# EAGLE design shield-v2.0 (EAGLE 8.3.1)
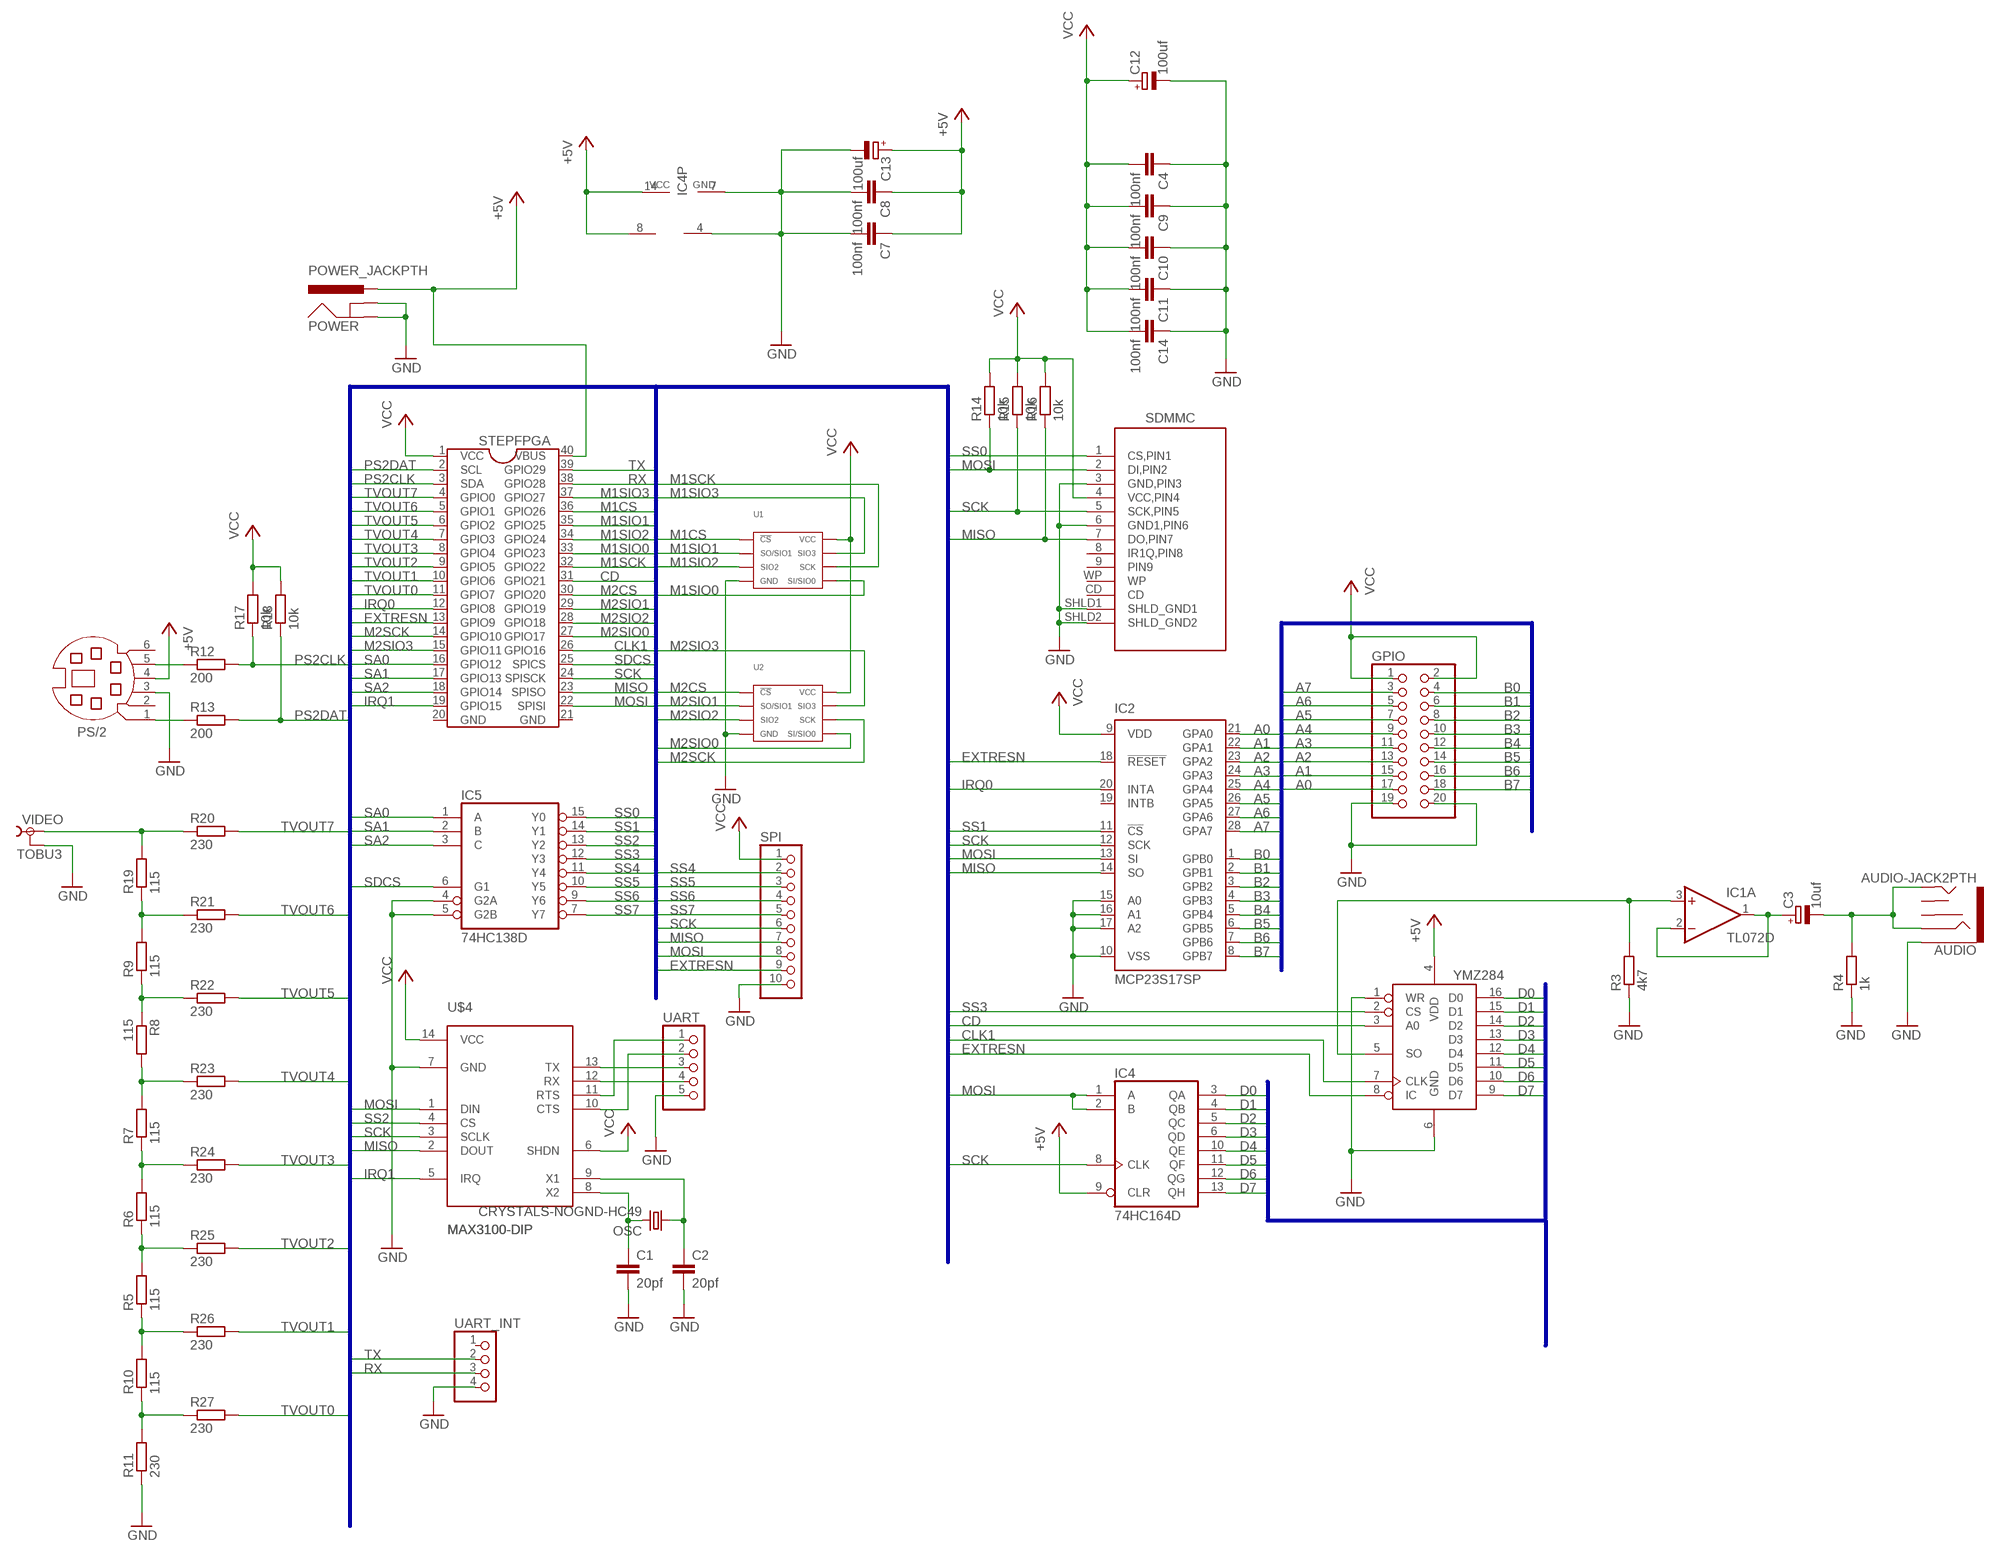
[diagram p0: schematic, sheet 1]

## Parts
AUDIO  AUDIO-JACK2PTH  [AUDIO-JACK]
C1  20pf  CAP1206  [1206]
C2  20pf  CAP1206  [1206]
C3  10uf  CPOL-EUE5-5  [E5-5]
C4  100nf  CAP1206  [1206]
C7  100nf  CAP1206  [1206]
C8  100nf  CAP1206  [1206]
C9  100nf  CAP1206  [1206]
C10  100nf  CAP1206  [1206]
C11  100nf  CAP1206  [1206]
C12  100uf  CPOL-EUE5-5  [E5-5]
C13  100uf  CPOL-EUE5-5  [E5-5]
C14  100nf  CAP1206  [1206]
GPIO  PINHD-2X10  [2X10]
IC1  TL072D  [SO08]
IC2  MCP23S17SP  [DIL28-3]
IC3  YMZ284  [DIL16]
IC4  74HC164D  [SO14]
IC5  74HC138D  [SO16]
OSC  CRYSTALS-NOGND-HC49  [HC49]
POWER  POWER_JACKPTH  [POWER_JACK_PTH]
PS/2  MD06SS  [MDIN06SS]
R3  4k7  R-EU_R1206  [R1206]
R4  1k  R-EU_R1206  [R1206]
R5  115  R-EU_R1206  [R1206]
R6  115  R-EU_R1206  [R1206]
R7  115  R-EU_R1206  [R1206]
R8  115  R-EU_R1206  [R1206]
R9  115  R-EU_R1206  [R1206]
R10  115  R-EU_R1206  [R1206]
R11  230  R-EU_R1206  [R1206]
R12  200  R-EU_R1206  [R1206]
R13  200  R-EU_R1206  [R1206]
R14  10k  R-EU_R1206  [R1206]
R15  10k  R-EU_R1206  [R1206]
R16  10k  R-EU_R1206  [R1206]
R17  10k  R-EU_R1206  [R1206]
R18  10k  R-EU_R1206  [R1206]
R19  115  R-EU_R1206  [R1206]
R20  230  R-EU_R1206  [R1206]
R21  230  R-EU_R1206  [R1206]
R22  230  R-EU_R1206  [R1206]
R23  230  R-EU_R1206  [R1206]
R24  230  R-EU_R1206  [R1206]
R25  230  R-EU_R1206  [R1206]
R26  230  R-EU_R1206  [R1206]
R27  230  R-EU_R1206  [R1206]
SDMMC  FCI_SD_SOCKET  [SD-MMC_SOCKET-PP]
SPI  PINHD-1X10  [1X10]
STEPFPGA  STEPFPGA  [DIL40]
U1  23A1024/23LC1024-I/SN  [23A1024_SOIC-8]
U2  23A1024/23LC1024-I/SN  [23A1024_SOIC-8]
U$4  MAX3100-DIP  [DIL14]
UART  PINHD-1X5  [1X05]
UART_INT  PINHD-1X4  [1X04]
VIDEO  TOBU3  [TOBU3]

## Nets
+5V: C7.1 C8.1 C13.+ IC1.8(P:V+) IC3.4(VDD) IC4.9(CLR) IC4.14(VCC) POWER.PWR PS/2.4 STEPFPGA.40(VBUS)
A0: GPIO.17 IC2.21(GPA0)
A1: GPIO.15 IC2.22(GPA1)
A2: GPIO.13 IC2.23(GPA2)
A3: GPIO.11 IC2.24(GPA3)
A4: GPIO.9 IC2.25(GPA4)
A5: GPIO.7 IC2.26(GPA5)
A6: GPIO.5 IC2.27(GPA6)
A7: GPIO.3 IC2.28(GPA7)
B0: GPIO.4 IC2.1(GPB0)
B1: GPIO.6 IC2.2(GPB1)
B2: GPIO.8 IC2.3(GPB2)
B3: GPIO.10 IC2.4(GPB3)
B4: GPIO.12 IC2.5(GPB4)
B5: GPIO.14 IC2.6(GPB5)
B6: GPIO.16 IC2.7(GPB6)
B7: GPIO.18 IC2.8(GPB7)
CD: IC3.3(A0) STEPFPGA.31(GPIO21)
CLK1: IC3.7(CLK) STEPFPGA.26(GPIO16)
D0: IC3.16(D0) IC4.3(QA)
D1: IC3.15(D1) IC4.4(QB)
D2: IC3.14(D2) IC4.5(QC)
D3: IC3.13(D3) IC4.6(QD)
D4: IC3.12(D4) IC4.10(QE)
D5: IC3.11(D5) IC4.11(QF)
D6: IC3.10(D6) IC4.12(QG)
D7: IC3.9(D7) IC4.13(QH)
EXTRESN: IC2.18(!RESET) IC3.8(IC) SPI.9 STEPFPGA.13(GPIO9)
GND: AUDIO.SLEEVE C1.2 C2.2 C4.1 C7.2 C8.2 C9.1 C10.1 C11.1 C12.- C13.- C14.1 GPIO.19 GPIO.20 IC1.4(P:V-) IC2.10(VSS) IC2.15(A0) IC2.16(A1) IC2.17(A2) IC3.1(WR) IC3.6(GND) IC4.7(GND) IC5.4(G2A) IC5.5(G2B) POWER.GND POWER.GNDBREAK PS/2.3 R3.1 R4.1 R11.1 SDMMC.3(GND,PIN3) SDMMC.6(GND1,PIN6) SDMMC.SHLD1(SHLD_GND1) SDMMC.SHLD2(SHLD_GND2) SPI.10 U1.4(GND) U2.4(GND) U$4.7(GND) UART.5 UART_INT.4 VIDEO.2 VIDEO.2@1 VIDEO.2@2
IRQ0: IC2.20(INTA) STEPFPGA.12(GPIO8)
IRQ1: STEPFPGA.19(GPIO15) U$4.5(IRQ)
M1CS: STEPFPGA.36(GPIO26) U1.1(CS')
M1SCK: STEPFPGA.32(GPIO22) U1.6(SCK)
M1SIO0: STEPFPGA.33(GPIO23) U1.5(SI/SIO0)
M1SIO1: STEPFPGA.35(GPIO25) U1.2(SO/SIO1)
M1SIO2: STEPFPGA.34(GPIO24) U1.3(SIO2)
M1SIO3: STEPFPGA.37(GPIO27) U1.7(SIO3)
M2CS: STEPFPGA.30(GPIO20) U2.1(CS')
M2SCK: STEPFPGA.14(GPIO10) U2.6(SCK)
M2SIO0: STEPFPGA.27(GPIO17) U2.5(SI/SIO0)
M2SIO1: STEPFPGA.29(GPIO19) U2.2(SO/SIO1)
M2SIO2: STEPFPGA.28(GPIO18) U2.3(SIO2)
M2SIO3: STEPFPGA.15(GPIO11) U2.7(SIO3)
MISO: IC2.14(SO) R16.1 SDMMC.7(DO,PIN7) SPI.7 STEPFPGA.23(SPISO) U$4.2(DOUT)
MOSI: IC2.13(SI) IC4.1(A) IC4.2(B) R14.1 SDMMC.2(DI,PIN2) SPI.8 STEPFPGA.22(SPISI) U$4.1(DIN)
N$2: C1.1 OSC.2 U$4.8(X2)
N$3: U$4.13(TX) UART.3
N$4: U$4.12(RX) UART.4
N$5: U$4.11(RTS) UART.1
N$6: U$4.10(CTS) UART.2
N$7: C2.1 OSC.1 U$4.9(X1)
N$8: IC1.3(A:+IN) IC3.5(SO) R3.2
N$9: C3.+ IC1.1(A:OUT) IC1.2(A:-IN)
N$10: R19.2 R20.1 VIDEO.1
N$11: AUDIO.RING AUDIO.TIP C3.- R4.2
N$13: R9.2 R19.1 R21.1
N$14: R8.1 R9.1 R22.1
N$15: R7.2 R8.2 R23.1
N$16: R6.2 R7.1 R24.1
N$17: R5.2 R6.1 R25.1
N$18: R5.1 R10.2 R26.1
N$19: R10.1 R11.2 R27.1
N$23: PS/2.5 R12.1
N$24: PS/2.1 R13.1
PS2CLK: R12.2 R17.1 STEPFPGA.3(SDA)
PS2DAT: R13.2 R18.1 STEPFPGA.2(SCL)
RX: STEPFPGA.38(GPIO28) UART_INT.3
SA0: IC5.1(A) STEPFPGA.16(GPIO12)
SA1: IC5.2(B) STEPFPGA.17(GPIO13)
SA2: IC5.3(C) STEPFPGA.18(GPIO14)
SCK: IC2.12(SCK) IC4.8(CLK) R15.1 SDMMC.5(SCK,PIN5) SPI.6 STEPFPGA.24(SPISCK) U$4.3(SCLK)
SDCS: IC5.6(G1) STEPFPGA.25(SPICS)
SS0: IC5.15(Y0) SDMMC.1(CS,PIN1)
SS1: IC2.11(!CS) IC5.14(Y1)
SS2: IC5.13(Y2) U$4.4(CS)
SS3: IC3.2(CS) IC5.12(Y3)
SS4: IC5.11(Y4) SPI.2
SS5: IC5.10(Y5) SPI.3
SS6: IC5.9(Y6) SPI.4
SS7: IC5.7(Y7) SPI.5
TVOUT0: R27.2 STEPFPGA.11(GPIO7)
TVOUT1: R26.2 STEPFPGA.10(GPIO6)
TVOUT2: R25.2 STEPFPGA.9(GPIO5)
TVOUT3: R24.2 STEPFPGA.8(GPIO4)
TVOUT4: R23.2 STEPFPGA.7(GPIO3)
TVOUT5: R22.2 STEPFPGA.6(GPIO2)
TVOUT6: R21.2 STEPFPGA.5(GPIO1)
TVOUT7: R20.2 STEPFPGA.4(GPIO0)
TX: STEPFPGA.39(GPIO29) UART_INT.2
VCC: C4.2 C9.2 C10.2 C11.2 C12.+ C14.2 GPIO.1 GPIO.2 IC2.9(VDD) R14.2 R15.2 R16.2 R17.2 R18.2 SDMMC.4(VCC,PIN4) SPI.1 STEPFPGA.1(VCC) U1.8(VCC) U2.8(VCC) U$4.6(SHDN) U$4.14(VCC)
Unconnected: AUDIO.RSH AUDIO.TSH IC1.5(B:+IN) IC1.6(B:-IN) IC1.7(B:OUT) IC2.19(INTB) PS/2.2 PS/2.6 SDMMC.8(IR1Q,PIN8) SDMMC.9(PIN9) SDMMC.CD SDMMC.WP UART_INT.1

## Buses
PS2DAT,PS2CLK,RX,TX,TVOUT[0..7],MISO,MOSI,SCK,SDCS,EXTRESN,M1CS,M1SIO0,M1SIO1,M1SIO2,M1SIO3,M1SCK,M2CS,M2SIO0,M2SIO1,M2SIO2,M2SIO3,M2SCK,SS[0..7],SA[0..2],CD,CLK1,IRQ[0..1]
D[0..7]
A[0..7],B[0..7]

## Power pins joined to a net without a drawn wire
GND: IC5.8(GND) STEPFPGA.20(GND) STEPFPGA.21(GND)
VCC: IC5.16(VCC)

## Library data of the parts
AUDIO = SparkFun:AUDIO-JACK2
C1 C2 C4 C7-C11 C14 = SparkFun:CAP: Capacitor Standard 0603 ceramic capacitor, and 0.1" leaded capacitor.
C3 C12 C13 = rcl:CPOL-EU: POLARIZED CAPACITOR, European symbol
GPIO = pinhead:PINHD-2X10: PIN HEADER
IC1 = linear:TL072: OP AMP
IC2 = microchip:MCP23S17: http://ww1.microchip.com/downloads/en/DeviceDoc/21952a.pdf Source: http://ww1.microchip.com/downloads/en/DeviceDoc/21952a.pdf; MF: MICROCHIP; MPN: MCP23S17-E/SP; OC_FARNELL: 1292238; OC_NEWARK: 31K2951
IC3 = stepfpga:YMZ284
IC4 = 74xx-eu:74*164: 8-bit parallel out SHIFT REGISTER
IC5 = 74xx-eu:74*138: 3-line to 8-line DECODER/DEMULTIPLEXER
OSC = IQD-Frequency-Products:CRYSTALS-NOGND: CRYSTALS CAN NOT GROUNDED
POWER = SparkFun:POWER_JACK: Power Jack This is the standard 5.5mm barrel jack for power. The PTH is the most common, proven, reliable, footprint. All others are experimental. The Slot footprint only works if the mill layer is transmitted to the PCB fab house so be warned. Spark Fun Electronics SKU : PRT-00119. Mating wall wart : TOL-00298 (and others)
PS/2 = con-yamaichi:MD06SS: YAMAICHI CONNECTOR; OC_FARNELL: unknown; OC_NEWARK: unknown
R3-R27 = resistor:R-EU_: RESISTOR, European symbol
SDMMC = stepfpga:FCI_SD_SOCKET: FCI Memory Card Connector (SD card); MF: FCI; MOUSER: 649-10067847-001RLF; MPN: 10067847-001RLF
SPI = pinhead:PINHD-1X10: PIN HEADER
STEPFPGA = stepfpga:STEPFPGA: StepFPGA module
U1 U2 = stepfpga:23A1024/23LC1024: Manufacturer Part #: 23A1024/23LC1024 Manufacturer: Microchip Technology Description: SRAM 1024K 1.8V SPI SERIAL SRAM SQI
U$4 = stepfpga:MAX3100: UART to SPI controller
UART = pinhead:PINHD-1X5: PIN HEADER
UART_INT = pinhead:PINHD-1X4: PIN HEADER
VIDEO = con-hirschmann:TOBU3: Female Cinch CONNECTOR ( RCA Jack ); MF: FARNELL; MPN: TOBU 3; OC_FARNELL: 592791; OC_NEWARK: 06WX5914

## Board
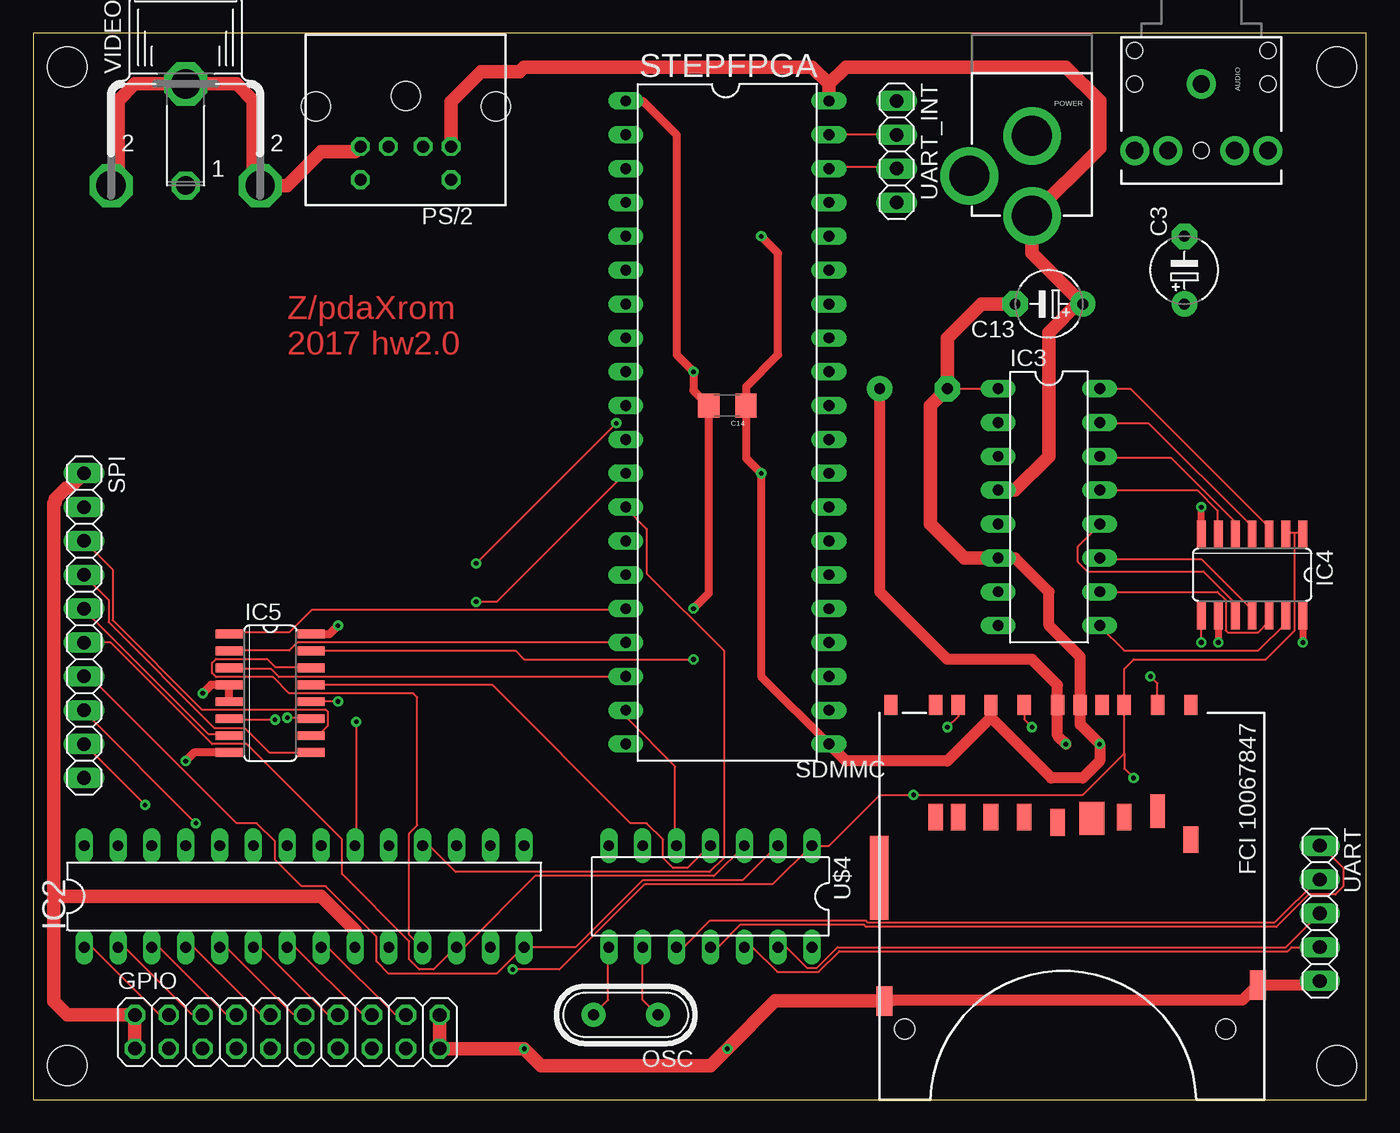
[diagram p1: board, top side]
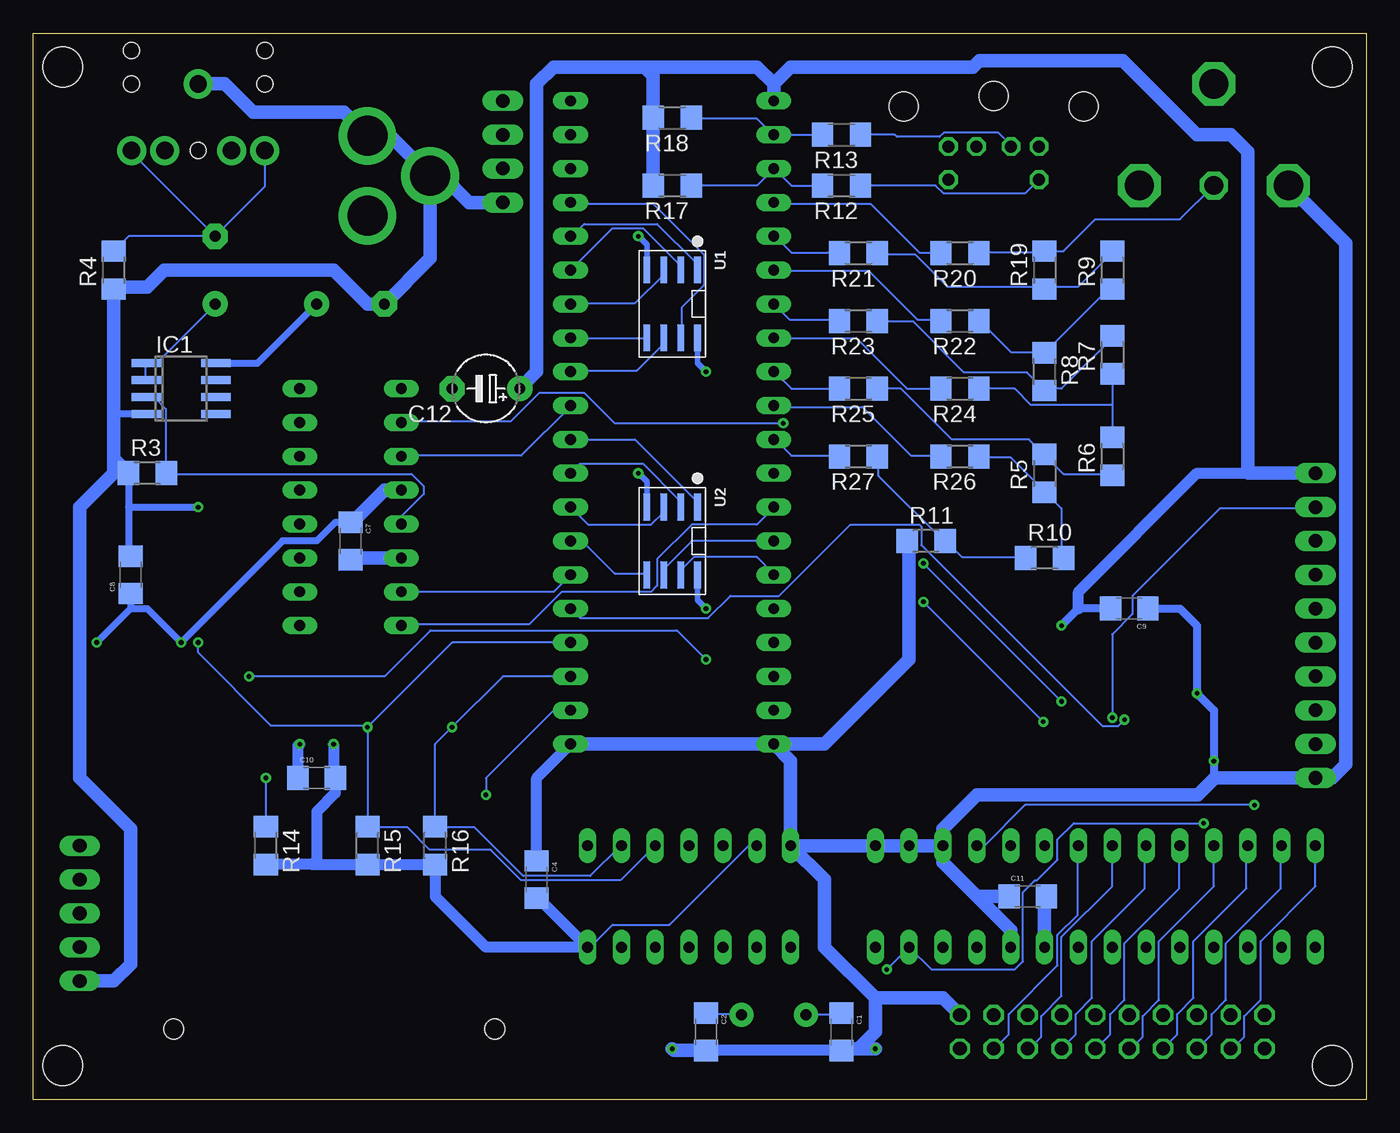
[diagram p2: board, bottom side, seen from below]

Size 100 x 80 mm. Coordinates in mm from the lower left corner, seen from the top.
Outline: 0,0 100,0 100,80 0,80 0,0
Copper layers (1*16): Top 0.035mm / dielectric 1.5mm / Bottom 0.035mm
Design rules "default *": minimum track width 6mil, minimum drill 0.35mm, track to track 6mil, track to pad 6mil, pad to pad 6mil, via to via 6mil, smd to smd 6mil, copper to edge 40mil, drill to drill 6mil, minimum pad ring 10mil, minimum via ring 8mil, stop-mask expansion 4mil, vias tented up to drill 0mil, thermal gap 10mil
Holes 3 mm at 2.54,2.54 97.79,2.54 97.79,77.47 2.54,77.47

### Footprints (pad centres in the part's own frame; a part is rotated, then mirrored left to right if it is on the bottom)
AUDIO-JACK = drill 1.3 pad 2.184: RING 5,5; RSH 5,2.5; SLEEVE 0,0; TIP 5,-5; TSH 5,-2.5 | hole 1.2: 0,5; -2.5,5; -2.5,-5; 0,-5; 5,0
1206 = smd 1.6 x 1.8: 1 -1.4,0; 2 1.4,0
E5-5 = drill 0.813 pad 1.905: + -2.54,0 | drill 0.813 pad 1.905 octagon: - 2.54,0
2X10 = drill 1.016 octagon: 1 -11.43,-1.27; 2 -11.43,1.27; 3 -8.89,-1.27; 4 -8.89,1.27; 5 -6.35,-1.27; 6 -6.35,1.27; 7 -3.81,-1.27; 8 -3.81,1.27; 9 -1.27,-1.27; 10 -1.27,1.27; 11 1.27,-1.27; 12 1.27,1.27; 13 3.81,-1.27; 14 3.81,1.27; 15 6.35,-1.27; 16 6.35,1.27; 17 8.89,-1.27; 18 8.89,1.27; 19 11.43,-1.27; 20 11.43,1.27
SO08 = smd 0.6 x 2.2: 1 -1.905,-2.6; 2 -0.635,-2.6; 3 0.635,-2.6; 4 1.905,-2.6; 5 1.905,2.6; 6 0.635,2.6; 7 -0.635,2.6; 8 -1.905,2.6
DIL28-3 = drill 0.813 long: 1 -16.51,-3.81; 2 -13.97,-3.81; 3 -11.43,-3.81; 4 -8.89,-3.81; 5 -6.35,-3.81; 6 -3.81,-3.81; 7 -1.27,-3.81; 8 1.27,-3.81; 9 3.81,-3.81; 10 6.35,-3.81; 11 8.89,-3.81; 12 11.43,-3.81; 13 13.97,-3.81; 14 16.51,-3.81; 15 16.51,3.81; 16 13.97,3.81; 17 11.43,3.81; 18 8.89,3.81; 19 6.35,3.81; 20 3.81,3.81; 21 1.27,3.81; 22 -1.27,3.81; 23 -3.81,3.81; 24 -6.35,3.81; 25 -8.89,3.81; 26 -11.43,3.81; 27 -13.97,3.81; 28 -16.51,3.81
DIL16 = drill 0.813 long: 1 -8.89,-3.81; 2 -6.35,-3.81; 3 -3.81,-3.81; 4 -1.27,-3.81; 5 1.27,-3.81; 6 3.81,-3.81; 7 6.35,-3.81; 8 8.89,-3.81; 9 8.89,3.81; 10 6.35,3.81; 11 3.81,3.81; 12 1.27,3.81; 13 -1.27,3.81; 14 -3.81,3.81; 15 -6.35,3.81; 16 -8.89,3.81
SO14 = smd 0.66 x 2.032: 1 -3.81,-3.073; 2 -2.54,-3.073; 3 -1.27,-3.073; 4 0,-3.073; 5 1.27,-3.073; 6 2.54,-3.073; 7 3.81,-3.073; 8 3.81,3.073; 9 2.54,3.073; 10 1.27,3.073; 11 0,3.073; 12 -1.27,3.073; 13 -2.54,3.073; 14 -3.81,3.073
SO16 = smd 0.66 x 2.032: 1 -4.445,-3.073; 2 -3.175,-3.073; 3 -1.905,-3.073; 4 -0.635,-3.073; 5 0.635,-3.073; 6 1.905,-3.073; 7 3.175,-3.073; 8 4.445,-3.073; 9 4.445,3.073; 10 3.175,3.073; 11 1.905,3.073; 12 0.635,3.073; 13 -0.635,3.073; 14 -1.905,3.073; 15 -3.175,3.073; 16 -4.445,3.073
HC49 = drill 0.813 pad 1.8: 1 -2.413,0; 2 2.413,0
POWER_JACK_PTH = drill 2.997 pad 4.318: GND 0,7.7; GNDBREAK 4.7,10.7; PWR 0,13.7
MDIN06SS = drill 0.9 octagon: 1 1.3,8.5; 2 -1.3,8.5; 3 3.4,8.5; 4 -3.4,8.5; 5 3.4,11; 6 -3.4,11 | hole 2.2: -6.75,5.5; 0,4.7; 6.75,5.5
R1206 = smd 1.6 x 1.803: 1 -1.422,0; 2 1.422,0
SD-MMC_SOCKET-PP = smd 1 x 1.5: 1 6.875,29.6; 2 4.375,29.6; 3 1.075,29.6; 4 -0.625,29.6; 5 -3.125,29.6; 6 -5.625,29.6; 7 -8.075,29.6; 8 -9.775,29.6; 9 9.375,29.6; CD 2.725,29.6; WP -13.125,29.6 | smd 1.4 x 6.3: 14 -14,16.65 | smd 1.2 x 2.2: SHLD1 -13.6,7.4; SHLD2 14.4,8.6 | smd 1.1 x 2: SW -9.775,21.2; SW1 -8.075,21.2; SW2 -5.625,21.2; SW3 -3.125,21.2; SW4 -0.625,20.8; SW6 4.375,21.2; SW8 9.375,19.5 | smd 1.9 x 2.5: SW5 1.95,21.1 | smd 1.1 x 2.5: SW7 6.875,21.65 | hole 1.5: -12.1,5.3; 12,5.3
1X10 = drill 1.016 long: 1 -11.43,0; 2 -8.89,0; 3 -6.35,0; 4 -3.81,0; 5 -1.27,0; 6 1.27,0; 7 3.81,0; 8 6.35,0; 9 8.89,0; 10 11.43,0
DIL40 = drill 0.813 long: 1 -24.13,-7.62; 2 -21.59,-7.62; 3 -19.05,-7.62; 4 -16.51,-7.62; 5 -13.97,-7.62; 6 -11.43,-7.62; 7 -8.89,-7.62; 8 -6.35,-7.62; 9 -3.81,-7.62; 10 -1.27,-7.62; 11 1.27,-7.62; 12 3.81,-7.62; 13 6.35,-7.62; 14 8.89,-7.62; 15 11.43,-7.62; 16 13.97,-7.62; 17 16.51,-7.62; 18 19.05,-7.62; 19 21.59,-7.62; 20 24.13,-7.62; 21 24.13,7.62; 22 21.59,7.62; 23 19.05,7.62; 24 16.51,7.62; 25 13.97,7.62; 26 11.43,7.62; 27 8.89,7.62; 28 6.35,7.62; 29 3.81,7.62; 30 1.27,7.62; 31 -1.27,7.62; 32 -3.81,7.62; 33 -6.35,7.62; 34 -8.89,7.62; 35 -11.43,7.62; 36 -13.97,7.62; 37 -16.51,7.62; 38 -19.05,7.62; 39 -21.59,7.62; 40 -24.13,7.62
23A1024_SOIC-8 = smd 2 x 0.5: 1 -2.55,1.905; 2 -2.55,0.635; 3 -2.55,-0.635; 4 -2.55,-1.905; 5 2.55,-1.905; 6 2.55,-0.635; 7 2.55,0.635; 8 2.55,1.905
DIL14 = drill 0.813 long: 1 -7.62,-3.81; 2 -5.08,-3.81; 3 -2.54,-3.81; 4 0,-3.81; 5 2.54,-3.81; 6 5.08,-3.81; 7 7.62,-3.81; 8 7.62,3.81; 9 5.08,3.81; 10 2.54,3.81; 11 0,3.81; 12 -2.54,3.81; 13 -5.08,3.81; 14 -7.62,3.81
1X05 = drill 1.016 long: 1 -5.08,0; 2 -2.54,0; 3 0,0; 4 2.54,0; 5 5.08,0
1X04 = drill 1.016 long: 1 -3.81,0; 2 -1.27,0; 3 1.27,0; 4 3.81,0
TOBU3 = drill 1.397 octagon: 1 0,-2.54 | drill 2.21 octagon: 2 5.588,-2.54; 2@1 -5.588,-2.54; 2@2 0,5.08

### Placement (x,y rotation side)
AUDIO  87.63,76.2 270 top
C1  39.37,5.08 270 bottom
C2  49.53,5.08 270 bottom
C3  86.36,62.23 90 top
C4  62.23,16.51 270 bottom
C7  76.2,41.91 270 bottom
C8  92.71,39.37 90 bottom
C9  17.78,36.83 180 bottom
C10  78.74,24.13 0 bottom
C11  25.4,15.24 0 bottom
C12  66.04,53.34 180 bottom
C13  76.2,59.69 180 top
C14  52.07,52.07 180 top
GPIO  19.05,5.08 0 top
IC1  88.9,53.34 270 bottom
IC2  20.32,15.24 0 top
IC3  76.2,44.45 270 top
IC4  91.44,39.37 180 top
IC5  17.78,30.48 270 top
OSC  44.45,6.35 180 top
POWER  74.93,80.01 180 top
PS/2  27.94,80.01 180 top
R3  91.44,46.99 0 bottom
R4  93.98,62.23 90 bottom
R5  24.13,46.99 90 bottom
R6  19.05,48.26 90 bottom
R7  19.05,55.88 90 bottom
R8  24.13,54.61 270 bottom
R9  19.05,62.23 90 bottom
R10  24.13,40.64 0 bottom
R11  33.02,41.91 0 bottom
R12  39.37,68.58 180 bottom
R13  39.37,72.39 180 bottom
R14  82.55,19.05 270 bottom
R15  74.93,19.05 270 bottom
R16  69.85,19.05 270 bottom
R17  52.07,68.58 180 bottom
R18  52.07,73.66 180 bottom
R19  24.13,62.23 90 bottom
R20  30.48,63.5 180 bottom
R21  38.1,63.5 180 bottom
R22  30.48,58.42 180 bottom
R23  38.1,58.42 180 bottom
R24  30.48,53.34 180 bottom
R25  38.1,53.34 180 bottom
R26  30.48,48.26 180 bottom
R27  38.1,48.26 180 bottom
SDMMC  77.47,0 0 top
SPI  3.81,35.56 270 top
STEPFPGA  52.07,50.8 270 top
U1  52.07,59.69 270 bottom
U2  52.07,41.91 270 bottom
U$4  50.8,15.24 180 top
UART  96.52,13.97 270 top
UART_INT  64.77,71.12 270 top
VIDEO  11.43,71.12 0 top

### Tracks (layer width: path | path; a pad name or v marks a point on that pad's centre or on a via)
+5V  (via drill 0.35)
  Top 0.508: IC4.14 v95.25,34.29 | IC4.9 v88.9,34.29
  Top 1.016: PS/2.4 31.34,74.87 33.6,77.13 36.49,77.13 36.83,77.47 58.42,77.47 59.69,76.2 | STEPFPGA.40 59.69,76.2 | 59.69,76.2 60.96,77.47 77.47,77.47 80.01,74.93 80.01,71.39 POWER.PWR 74.93,63.5 78.54,59.89 | 78.54,59.89 C13.+ | IC3.4 73.66,45.72 76.2,48.26 76.2,57.56 78.54,59.89
  Bottom 0.508: IC1.8 83.19,55.24 C13.+ | C8.1 92.71,36.83 | 92.71,36.83 v95.25,34.29 | 92.71,36.83 91.44,36.83 v88.91,34.3 | v88.91,34.3 v88.9,34.29 | C7.1 77.34,43.31 78.74,41.91 81.3,41.91 v88.91,34.3
  Bottom 1.016: C7.1 76.07,43.31 73.66,45.72 IC3.4
A0
  Bottom 0.152: IC2.21 21.64,19.05 21.64,13.87 23.16,12.34 23.16,10.06 26.82,6.4 26.82,4.88 27.89,3.81 GPIO.17
A1
  Bottom 0.152: IC2.22 19.05,16 22.86,12.19 22.86,7.77 24.38,6.25 24.38,4.72 25.3,3.81 GPIO.15
A2
  Bottom 0.152: GPIO.13 21.79,4.88 21.79,6.4 20.57,7.62 20.57,11.89 16.61,15.85 16.61,19.05 IC2.23
A3
  Bottom 0.152: IC2.24 14.02,19.05 14.02,15.85 18.14,11.73 18.14,7.47 19.2,6.4 19.2,4.88 20.27,3.81 GPIO.11
A4
  Bottom 0.152: IC2.25 11.43,16 15.54,11.89 15.54,7.47 16.76,6.25 16.76,4.72 17.68,3.81 GPIO.9
A5
  Bottom 0.152: GPIO.7 14.17,4.88 14.17,6.4 12.95,7.62 12.95,11.89 8.99,15.85 8.99,19.05 IC2.26
A6
  Bottom 0.152: IC2.27 6.4,19.05 6.4,15.85 10.52,11.73 10.52,7.47 11.58,6.4 11.58,4.88 12.65,3.81 GPIO.5
A7
  Bottom 0.152: IC2.28 3.81,16 7.92,11.89 7.92,7.47 9.14,6.25 9.14,4.72 10.06,3.81 GPIO.3
B0
  Top 0.152: IC2.1 4.42,11.43 9.45,6.4 10.06,6.4 GPIO.4
B1
  Top 0.152: IC2.2 6.86,11.43 11.89,6.4 12.65,6.4 GPIO.6
B2
  Top 0.152: IC2.3 9.45,11.43 14.48,6.4 15.24,6.4 GPIO.8
B3
  Top 0.152: IC2.4 12.04,11.43 17.07,6.4 17.68,6.4 GPIO.10
B4
  Top 0.152: IC2.5 14.48,11.43 19.51,6.4 20.27,6.4 GPIO.12
B5
  Top 0.152: IC2.6 17.07,11.43 22.1,6.4 22.86,6.4 GPIO.14
B6
  Top 0.152: IC2.7 19.66,11.43 24.69,6.4 25.3,6.4 GPIO.16
B7
  Top 0.152: IC2.8 22.1,11.43 27.13,6.4 27.89,6.4 GPIO.18
CD
  Bottom 0.152: IC3.3 72.39,48.31 63.4,48.31 59.74,51.97 STEPFPGA.31
CLK1
  Bottom 0.152: IC3.7 60.96,38.1 STEPFPGA.26
D0
  Top 0.152: IC3.16 82.3,53.34 92.66,42.98 92.66,42.52 IC4.3
D1
  Top 0.152: IC4.4 91.44,42.98 83.67,50.75 80.01,50.75 IC3.15
D2
  Top 0.152: IC4.5 90.07,42.52 90.07,43.43 85.34,48.16 80.01,48.16 IC3.14
D3
  Top 0.152: IC3.13 87.33,45.72 88.85,44.2 88.85,42.52 IC4.6
D4
  Top 0.152: IC4.10 90.07,36.42 90.07,37.34 87.78,39.62 79.1,39.62 78.33,40.39 78.33,41.45 80.01,43.13 IC3.12
D5
  Top 0.152: IC4.11 91.44,36.73 87.63,40.54 80.01,40.54 IC3.11
D6
  Top 0.152: IC3.10 88.85,38.1 89.46,37.49 89.46,35.2 89.61,35.05 91.9,35.05 92.66,35.81 92.66,36.27 IC4.12
D7
  Top 0.152: IC4.13 93.88,36.27 93.88,35.66 91.9,33.68 81.84,33.68 80.01,35.51 IC3.9
EXTRESN  (via drill 0.35)
  Top 0.152: SPI.9 v8.38,22.1 | IC2.18 29.72,19.05 31.7,17.07 50.75,17.07 51.82,18.14 51.82,33.68 46.02,39.47 46.02,42.82 44.5,44.35 STEPFPGA.13
  Bottom 0.152: IC2.18 28.65,19.05 25.6,22.1 v8.38,22.1 | IC3.8 72.39,35.66 62.79,35.66 60.35,38.1 53.65,38.1 53.19,38.56 53.19,40.54 50.6,43.13 45.72,43.13 44.5,44.35 STEPFPGA.13
GND  (via drill 0.35)
  Top 0.152: C12.- IC3.1
  Top 0.508: IC4.7 v87.63,44.45
  Top 0.61: IC5.8 12.06,26.04 v11.43,25.4 | IC5.5 IC5.4 13.34,31.11 v12.7,30.48 | v54.61,64.77 55.88,63.5 55.88,55.88 53.47,53.47 C14.1 53.47,48.13 v54.61,46.99 54.61,31.75 STEPFPGA.21
  Top 0.813: UART.5 96.23,8.6 SDMMC.SHLD2 90.74,7.47 64.47,7.47 64.4,7.4 SDMMC.SHLD1 | 71.84,28.66 SDMMC.6 | 71.84,28.66 68.58,25.4 60.96,25.4 STEPFPGA.21 | 71.84,28.66 76.38,24.13 78.74,24.13 80.01,25.4 v80.01,26.67 78.55,28.14 SDMMC.3 78.55,33.22 76.2,35.56 76.2,38.1 73.66,40.64 IC3.6
  Top 1.016: IC3.6 69.85,40.64 67.31,43.18 67.31,52.07 C12.- 68.58,57.15 71.12,59.69 C13.- | PS/2.3 24.15,71.12 21.59,71.12 19.05,68.58 VIDEO.2 16.51,69.09 16.51,74.93 15.24,76.2 VIDEO.2@2 7.62,76.2 6.35,74.93 6.35,69.09 VIDEO.2@1 | GPIO.20 GPIO.19 v36.83,3.81 38.1,2.54 50.8,2.54 v52.07,3.81 55.66,7.4 SDMMC.SHLD1
  Bottom 0.406: U1.4 53.98,64.14 v54.61,64.77 | U2.4 53.98,46.35 v54.61,46.99
  Bottom 0.508: 94.13,60.81 R4.1 | R3.1 92.86,44.45 | 92.86,44.45 92.86,40.92 C8.2 | 92.86,44.45 v87.63,44.45 | IC1.4 93.96,51.44 93.98,51.46
  Bottom 0.61: C9.1 13.97,36.83 12.7,35.56 v12.7,30.48 11.43,29.21 v11.43,25.4 11.43,24.2 11.36,24.13
  Bottom 0.813: C10.1 80.14,26.54 v80.01,26.67 | C4.1 62.23,24.13 STEPFPGA.21 | C1.2 C2.2
  Bottom 1.016: IC3.6 76.07,40.64 C7.2 | POWER.GNDBREAK 73.23,72.31 POWER.GND 76.7,74.08 83.51,74.08 85.63,76.2 AUDIO.SLEEVE | POWER.GNDBREAK 70.23,63.12 C13.- 74.93,59.69 77.47,62.23 90.17,62.23 91.44,60.96 93.83,60.96 R4.1 93.98,51.46 93.98,48.11 | POWER.GNDBREAK 69.31,69.31 67.31,67.31 UART_INT.4 | STEPFPGA.21 STEPFPGA.20 | U$4.7 43.18,25.4 STEPFPGA.20 | 30.61,3.68 GPIO.19 | STEPFPGA.20 40.64,26.67 34.29,33.02 34.29,41.76 R11.1 | VIDEO.2@1 1.52,64.26 1.52,25.15 2.54,24.13 SPI.10 11.36,24.13 12.63,22.86 29.21,22.86 31.75,20.32 IC2.17 | 36.83,7.62 40.64,11.43 40.64,16.51 U$4.7 | U$4.7 IC2.15 IC2.16 IC2.17 | 29.21,15.24 C11.1 | 29.21,15.24 31.75,17.78 IC2.17 | IC2.10 26.67,12.7 29.21,15.24 | 36.83,7.62 31.75,7.62 GPIO.20 | 36.83,7.62 36.83,5.08 38.1,3.81 | 38.1,3.81 39.24,3.81 C1.2 | C2.2 51.94,3.68 v52.07,3.81 | 38.1,3.81 v36.83,3.81 | 93.98,48.11 R3.1 | 93.98,48.11 93.98,46.99 96.52,44.45 96.52,24.13 92.71,20.32 92.71,10.16 93.98,8.89 UART.5
IRQ0  (via drill 0.35)
  Top 0.152: v24.23,28.35 24.23,19.05 IC2.20 | v33.22,37.34 34.75,37.34 44.35,46.94 STEPFPGA.12
  Bottom 0.152: v33.22,37.34 v24.23,28.35
IRQ1
  Top 0.152: STEPFPGA.19 44.5,29.11 44.5,28.65 48.16,24.99 48.16,19.05 U$4.5
M1CS
  Bottom 0.152: U1.1 50.29,62.33 50.29,62.79 53.19,65.68 58.67,65.68 59.59,64.77 STEPFPGA.36
M1SCK
  Bottom 0.152: U1.6 52.73,57 52.73,56.69 54.71,54.71 59.59,54.71 STEPFPGA.32
M1SIO0
  Bottom 0.152: STEPFPGA.33 54.1,57.15 U1.5
M1SIO1
  Bottom 0.152: STEPFPGA.35 56.54,65.38 54.25,65.38 51.51,62.64 51.51,62.33 U1.2
M1SIO2
  Bottom 0.152: U1.3 52.73,62.18 52.73,61.87 54.86,59.74 59.59,59.74 STEPFPGA.34
M1SIO3
  Bottom 0.152: U1.7 51.36,57.15 51.36,59.44 49.68,61.11 49.68,63.4 53.49,67.21 59.59,67.21 STEPFPGA.37
M2CS
  Bottom 0.152: STEPFPGA.30 54.86,49.53 50.29,44.96 50.29,44.5 U2.1
M2SCK
  Bottom 0.152: STEPFPGA.14 50.6,41.91 52.58,39.93 52.58,39.47 U2.6
M2SIO0
  Bottom 0.152: STEPFPGA.27 58.83,41.91 56.39,39.47 54.1,39.47 U2.5
M2SIO1
  Bottom 0.152: STEPFPGA.29 58.98,47.7 54.25,47.7 51.51,44.96 51.51,44.5 U2.2
M2SIO2
  Bottom 0.152: STEPFPGA.28 58.37,43.13 53.65,43.13 52.73,44.04 52.73,44.35 U2.3
M2SIO3
  Bottom 0.152: U2.7 51.36,39.47 51.36,39.78 50.44,40.69 45.72,40.69 44.5,39.47 STEPFPGA.15
MISO  (via drill 0.35)
  Top 0.152: U$4.2 55.78,19.05 53.19,16.46 45.72,16.46 40.69,11.43 IC2.14 36.73,11.43 34.75,9.45 26.67,9.45 25.76,10.36 25.76,12.19 21.95,16 20.12,16 18.14,17.98 18.14,19.36 16.76,20.73 15.24,20.73 4.27,31.7 3.81,31.7 SPI.7 | SDMMC.7 69.39,28.75 v68.58,27.94
  Bottom 0.152: U$4.2 55.93,19.05 58.22,16.76 63.25,16.76 66.9,20.42 69.8,20.42 R16.1 69.85,26.67 v68.58,27.94 64.77,31.75 STEPFPGA.23
MOSI  (via drill 0.35)
  Top 0.152: v35.97,9.75 39.47,9.75 45.87,16.15 55.47,16.15 58.37,19.05 U$4.1 59.69,19.05 63.5,22.86 v66.04,22.86 78.74,22.86 81.84,25.96 | v12.19,20.73 3.81,29.11 SPI.8 | 81.84,25.96 SDMMC.2 | 81.84,25.96 81.84,24.84 v82.55,24.13 | 94.64,42.52 95.25,42.52 IC4.1 | 94.64,42.52 94.03,42.52 IC4.2 | 94.64,42.52 94.64,35.2 92.46,33.02 82.55,33.02 81.84,32.31 SDMMC.2 | SDMMC.2 81.99,29.72
  Bottom 0.152: v35.97,9.75 IC2.13 32.61,9.75 26.36,9.75 25.76,10.36 25.76,15.54 24.84,16.46 24.69,16.46 23.16,17.98 23.16,19.51 21.95,20.73 v12.19,20.73 | R14.1 v82.55,24.13 | STEPFPGA.22 60.96,29.21 66.04,24.13 v66.04,22.86
N$2
  Top 0.152: U$4.8 43.13,11.43 43.13,7.47 42.06,6.4 OSC.2
  Bottom 0.152: C1.1 39.47,6.4 41.91,6.4 OSC.2
N$3
  Top 0.152: UART.3 93.98,11.43 60.34,11.43 58.79,9.88 58.05,9.88 56.5,11.43 U$4.13
N$4
  Top 0.152: UART.4 94.41,11.43 94.11,11.12 60.46,11.12 58.91,9.58 55.82,9.58 53.96,11.43 U$4.12
N$5
  Top 0.152: U$4.11 51.36,11.43 53.03,13.11 62.33,13.11 62.48,12.95 93.27,12.95 95.71,15.39 97.69,15.39 98.3,16 98.3,17.37 96.62,19.05 UART.1
N$6
  Top 0.152: U$4.10 48.77,11.43 50.75,13.41 62.48,13.41 62.64,13.26 93.12,13.26 96.47,16.61 UART.2
N$7
  Top 0.152: U$4.9 45.72,7.47 46.79,6.4 OSC.1
  Bottom 0.152: C2.1 49.53,6.4 46.94,6.4 OSC.1
N$8
  Bottom 0.152: IC1.3 91.44,52.58 90.83,52.58 90.07,51.82 90.07,47.09 R3.2 89.92,46.94 71.63,46.94 70.71,46.02 70.71,45.41 72.39,43.74 IC3.5
N$9
  Bottom 0.152: IC1.2 91.59,54.1 91.59,55.17 IC1.1 91.44,55.32 90.68,55.32 86.41,59.59 C3.+
N$10
  Bottom 0.152: R20.1 28.96,63.55 24.23,63.55 R19.2 22.71,63.65 20.32,66.04 13.97,66.04 VIDEO.1
N$11
  Bottom 0.152: AUDIO.RING 92.63,71.04 C3.- | AUDIO.TIP 82.63,68.5 C3.- | C3.- 92.86,64.77 R4.2
N$13
  Bottom 0.152: R9.2 19.05,63.55 21.64,60.96 24.08,60.96 R19.1 24.23,60.96 31.39,60.96 33.83,63.4 36.58,63.4 R21.1
N$14
  Bottom 0.152: R22.1 28.96,58.37 26.67,56.08 24.23,56.08 R8.1 24.08,56.08 19.36,60.81 R9.1 | R9.1
N$15
  Bottom 0.152: R7.2 19.05,57.15 22.86,53.34 24.08,53.34 R8.2 24.23,53.34 25.45,54.56 30.18,54.56 33.98,58.37 36.58,58.37 R23.1
N$16
  Bottom 0.152: R7.1 19.05,52.12 | 19.05,52.12 R6.2 | R24.1 26.36,53.34 25.15,52.12 19.05,52.12
N$17
  Bottom 0.152: R6.1 19.05,46.94 22.71,46.94 24.08,48.31 R5.2 24.23,48.46 25.3,49.53 31.09,49.53 34.9,53.34 R25.1
N$18
  Bottom 0.152: R10.2 22.86,40.69 22.86,44.35 24.08,45.57 R5.1 24.23,45.72 26.67,48.16 28.96,48.16 R26.1
N$19
  Bottom 0.152: R10.1 25.6,40.69 30.33,40.69 31.55,41.91 R11.2 31.7,41.91 36.58,46.79 36.58,48.16 R27.1
N$23
  Bottom 0.152: R12.1 32.31,68.58 31.7,67.97 25.6,67.97 24.69,68.89 PS/2.5
N$24
  Bottom 0.152: R13.1 35.36,72.39 35.2,72.24 32,72.24 31.7,72.54 27.58,72.54 26.67,71.63 PS/2.1
PS2CLK
  Bottom 0.152: R12.2 43.13,68.58 44.35,69.8 STEPFPGA.3 45.72,68.58 R17.1
PS2DAT
  Bottom 0.152: R13.2 STEPFPGA.2 44.5,72.39 45.72,73.61 50.6,73.61 R18.1
RX
  Top 0.152: STEPFPGA.38 59.74,69.95 64.77,69.95 UART_INT.3
SA0
  Top 0.152: IC5.1 14.78,35.05 19.2,35.05 20.88,36.73 44.35,36.73 STEPFPGA.16
SA1
  Top 0.152: STEPFPGA.17 19.81,34.29 19.2,33.68 14.78,33.68 IC5.2
SA2
  Top 0.152: IC5.3 14.78,32.31 17.83,32.31 18.44,31.7 44.35,31.7 STEPFPGA.18
SCK  (via drill 0.35)
  Top 0.152: U$4.3 51.05,16.76 37.64,16.76 32.31,11.43 IC2.12 31.7,11.43 30.02,9.75 28.96,9.75 28.19,10.52 28.19,11.89 23.16,16.92 23.16,19.51 16,26.67 13.41,26.67 5.79,34.29 SPI.6 | SDMMC.5 74.34,28.52 v74.93,27.94 | v87.63,34.29 IC4.8
  Bottom 0.152: U$4.3 55.93,16.46 63.4,16.46 65.68,18.75 70.26,18.75 71.93,20.42 74.83,20.42 R15.1 v74.93,27.94 | STEPFPGA.24 68.58,34.29 v74.93,27.94 | v87.63,34.29 87.63,33.53 82.14,28.04 74.98,28.04 v74.93,27.94
SDCS  (via drill 0.35)
  Top 0.152: v18.14,28.5 14.78,28.5 IC5.6
  Bottom 0.152: v18.14,28.5 18.59,28.04 19.81,28.04 33.38,41.6 33.38,42.98 33.53,43.13 38.71,43.13 44.04,37.8 47.7,37.8 49.38,36.12 58.98,36.12 STEPFPGA.25
SS0  (via drill 0.35)
  Top 0.152: 84.28,29.72 SDMMC.1 84.34,31.23 v83.82,31.75 | IC5.15 20.88,33.68 36.17,33.68 36.83,33.02 v49.53,33.02
  Bottom 0.152: v83.82,31.75 73.66,31.75 70.21,35.2 51.71,35.2 v49.53,33.02
SS1
  Top 0.152: IC5.14 20.73,32.46 18.14,32.46 17.53,33.07 13.72,33.07 13.41,32.77 13.41,32 13.72,31.7 17.98,31.7 19.2,30.48 28.5,30.48 28.8,30.18 28.8,20.57 28.19,19.96 28.19,12.34 29.11,11.43 IC2.11
SS2
  Top 0.152: IC5.13 20.88,31.09 34.44,31.09 44.81,20.73 46.02,20.73 47.24,19.51 47.24,18.14 48.01,17.37 49.07,17.37 50.75,19.05 U$4.4
SS3  (via drill 0.35)
  Top 0.152: v22.86,29.87 20.88,29.87 IC5.12 | v43.74,50.75 v33.22,40.23
  Bottom 0.152: v33.22,40.23 v22.86,29.87 | v43.74,50.75 56.39,50.75 58.67,53.03 62.03,53.03 64.16,50.9 72.39,50.9 IC3.2
SS4  (via drill 0.35)
  Top 0.152: v19.05,28.65 20.73,28.65 IC5.11
  Bottom 0.152: v19.05,28.65 19.05,34.9 17.53,36.42 17.53,37.8 10.97,44.35 3.81,44.35 SPI.2
SS5
  Top 0.152: SPI.3 5.94,39.78 5.94,35.97 12.65,29.26 21.95,29.26 22.1,29.11 22.1,28.04 21.49,27.43 20.88,27.43 IC5.10
SS6
  Top 0.152: IC5.9 20.73,26.06 17.68,26.06 15.85,27.89 13.56,27.89 5.64,35.81 5.64,37.49 3.81,39.32 SPI.4
SS7
  Top 0.152: IC5.7 14.63,27.43 13.11,27.43 3.81,36.73 SPI.5
TVOUT0
  Bottom 0.152: R27.2 39.62,48.31 43.13,48.31 44.35,49.53 STEPFPGA.11
TVOUT1
  Bottom 0.152: R26.2 32,48.31 34.14,48.31 37.8,51.97 44.35,51.97 STEPFPGA.10
TVOUT2
  Bottom 0.152: R25.2 43.13,53.34 44.35,54.56 STEPFPGA.9
TVOUT3
  Bottom 0.152: R24.2 34.44,53.34 38.25,57.15 STEPFPGA.8
TVOUT4
  Bottom 0.152: STEPFPGA.7 43.28,58.52 39.62,58.52 R23.2
TVOUT5
  Bottom 0.152: R22.2 32,58.52 33.68,58.52 37.34,62.18 44.35,62.18 STEPFPGA.6
TVOUT6
  Bottom 0.152: R21.2 39.62,63.55 43.13,63.55 44.35,64.77 STEPFPGA.5
TVOUT7
  Bottom 0.152: R20.2 32,63.55 33.53,63.55 37.19,67.21 44.35,67.21 STEPFPGA.4
TX
  Top 0.152: UART_INT.2 STEPFPGA.39
VCC  (via drill 0.35)
  Top 0.61: IC5.16 22.23,34.92 v22.86,35.56 | STEPFPGA.1 45.72,74.93 48.26,72.39 48.26,55.88 v49.53,54.61 49.53,53.21 C14.2 50.67,37.97 v49.53,36.83
  Top 0.813: v77.47,26.67 76.84,27.3 SDMMC.4 76.84,31.11 74.93,33.02 68.58,33.02 63.5,38.1 C12.+
  Top 1.016: SPI.1 2.69,45.87 2.46,45.87 1.63,45.04 1.63,44.81 1.52,44.7 1.52,15.24 | 1.52,15.24 1.52,7.37 2.54,6.35 GPIO.2 GPIO.1 | 1.52,15.24 21.59,15.24 24.13,12.7 IC2.9
  Bottom 0.152: R15.2 74.98,17.68 74.98,17.63 | U$4.6 46.33,19.05 52.27,13.11 56.54,13.11 58.06,11.58 U$4.14
  Bottom 0.406: U1.8 50.16,55.24 v49.53,54.61 | U2.8 50.16,37.47 v49.53,36.83
  Bottom 0.61: C9.2 21.59,36.83 v22.86,35.56
  Bottom 0.813: 79.06,17.63 74.98,17.63 R15.2 R16.2 69.85,15.24 66.04,11.43 U$4.14 62.1,15.11 C4.2 | 79.06,17.63 R14.2 | 79.06,17.63 78.74,17.95 78.74,21.59 77.34,22.99 C10.2 77.47,24.26 v77.47,26.67 | 21.59,36.83 21.59,38.1 12.7,46.99 8.83,46.99
  Bottom 1.016: 44.45,76.2 45.72,77.47 54.14,77.47 | 54.14,77.47 60.96,77.47 62.23,76.2 62.23,54.61 C12.+ | R17.2 R18.2 53.49,76.82 54.14,77.47 | STEPFPGA.1 44.45,76.2 | 44.45,76.2 43.18,77.47 29.49,77.47 29.03,77.93 18.24,77.93 12.7,72.39 10.16,72.39 8.89,71.12 8.89,47.05 8.83,46.99 SPI.1 | IC2.9 24.13,15.11 C11.2

### Text on the board
Top: Z/pdaXrom / 2017 hw2.0